# EAGLE design usbhub (EAGLE 7.6.0)
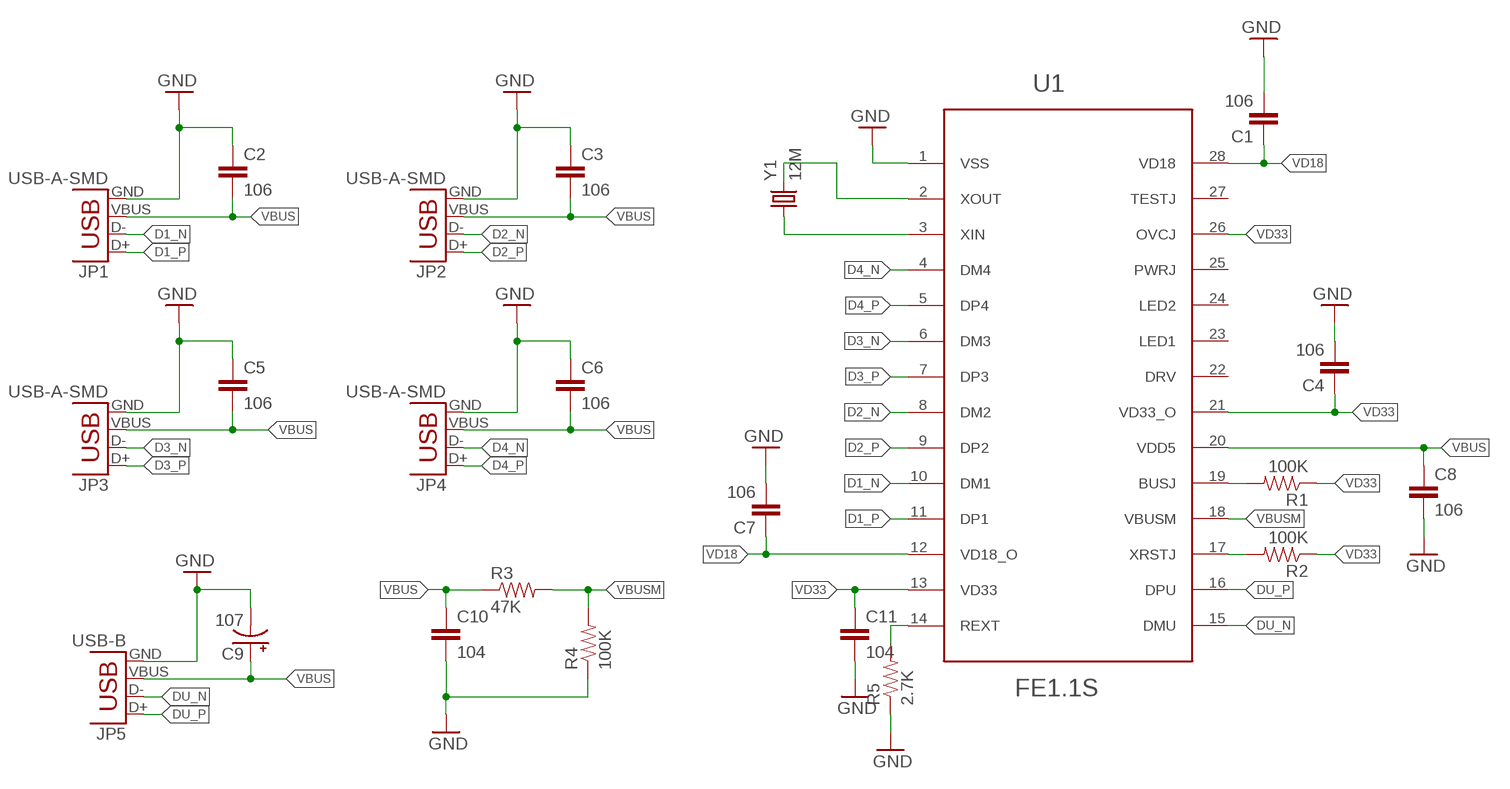
[diagram p0: schematic, sheet 1]

## Parts
C1  106  CAP0603-CAP  [0603-CAP]
C2  106  CAP0603-CAP  [0603-CAP]
C3  106  CAP0603-CAP  [0603-CAP]
C4  106  CAP0603-CAP  [0603-CAP]
C5  106  CAP0603-CAP  [0603-CAP]
C6  106  CAP0603-CAP  [0603-CAP]
C7  106  CAP0603-CAP  [0603-CAP]
C8  106  CAP0603-CAP  [0603-CAP]
C9  107  CAP_POL3528-KIT  [EIA3528-KIT]
C10  104  CAP0603-CAP  [0603-CAP]
C11  104  CAP0603-CAP  [0603-CAP]
JP1  USB-A-SMD  [USB-A-S-NOSILK-FEMALE]
JP2  USB-A-SMD  [USB-A-S-NOSILK-FEMALE]
JP3  USB-A-SMD  [USB-A-S-NOSILK-FEMALE]
JP4  USB-A-SMD  [USB-A-S-NOSILK-FEMALE]
JP5  USB-B  USBPTH  [USB-B-PTH]
R1  100K  RESISTOR0603-RES  [0603-RES]
R2  100K  RESISTOR0603-RES  [0603-RES]
R3  47K  RESISTOR0603-RES  [0603-RES]
R4  100K  RESISTOR0603-RES  [0603-RES]
R5  2.7K  RESISTOR0603-RES  [0603-RES]
U1  FE1.1S  [SSOP28-39]
Y1  12M  CRYSTAL2HC49US  [HC49US]

## Nets
D1_N: JP1.D- U1.10(DM1)
D1_P: JP1.D+ U1.11(DP1)
D2_N: JP2.D- U1.8(DM2)
D2_P: JP2.D+ U1.9(DP2)
D3_N: JP3.D- U1.6(DM3)
D3_P: JP3.D+ U1.7(DP3)
D4_N: JP4.D- U1.4(DM4)
D4_P: JP4.D+ U1.5(DP4)
DU_N: JP5.D- U1.15(DMU)
DU_P: JP5.D+ U1.16(DPU)
GND: C1.2 C2.1 C3.1 C4.2 C5.1 C6.1 C7.2 C8.2 C9.C(-) C10.2 C11.2 JP1.GND JP2.GND JP3.GND JP4.GND JP5.GND R4.1 R5.1 U1.1(VSS)
N$1: U1.2(XOUT) Y1.2
N$4: U1.3(XIN) Y1.1
N$6: R5.2 U1.14(REXT)
N$7: R1.2 U1.19(BUSJ)
N$8: R2.2 U1.17(XRSTJ)
VBUS: C2.2 C3.2 C5.2 C6.2 C8.1 C9.A(+) C10.1 JP1.VBUS JP2.VBUS JP3.VBUS JP4.VBUS JP5.VBUS R3.1 U1.20(VDD5)
VBUSM: R3.2 R4.2 U1.18(VBUSM)
VD18: C1.1 C7.1 U1.12(VD18_O) U1.28(VD18)
VD33: C4.1 C11.1 R1.1 R2.1 U1.13(VD33) U1.21(VD33_O) U1.26(OVCJ)
Unconnected: U1.22(DRV) U1.23(LED1) U1.24(LED2) U1.25(PWRJ) U1.27(TESTJ)

## Library data of the parts
C1 C4 C7 C8 C11 = xmgu2008:CAP: Capacitor Standard 0603 ceramic capacitor, and 0.1" leaded capacitor.
C2 C3 C5 C6 C10 = z_jlc_smt:CAP: Capacitor Standard 0603 ceramic capacitor, and 0.1" leaded capacitor.
C9 = z_jlc_smt:CAP_POL: Capacitor Polarized These are standard SMD and PTH capacitors. Normally 10uF, 47uF, and 100uF in electrolytic and tantalum varieties. Always verify the external diameter of the through hole cap, it varies with capacity, voltage, and manufacturer. The EIA devices should be standard.
JP1-JP4 = xmgu2008:USB: USB Connectors USB-B-PTH is fully proven SKU : PRT-00139/CONN-08278 USB-miniB is fully proven SKU : PRT-00587 USB-A-PCB is untested. USB-A-H is throughly reviewed, but untested. Spark Fun Electronics SKU : PRT-00437 USB-B-SMT is throughly reviewed, but untested. Needs silkscreen touching up. USB-A-S has not been used/tested USB-MB-H has not been used/tested USB-MICROB has been used. CONN-09505; PROD_ID: CONN-09520
JP5 = xmgu2008:USB: USB Connectors USB-B-PTH is fully proven SKU : PRT-00139/CONN-08278 USB-miniB is fully proven SKU : PRT-00587 USB-A-PCB is untested. USB-A-H is throughly reviewed, but untested. Spark Fun Electronics SKU : PRT-00437 USB-B-SMT is throughly reviewed, but untested. Needs silkscreen touching up. USB-A-S has not been used/tested USB-MB-H has not been used/tested USB-MICROB has been used. CONN-09505; PROD_ID: CONN-08278
R1-R5 = xmgu2008:RESISTOR: Resistor Basic schematic elements and footprints for 0603, 1206, and PTH resistors.
U1 = xmgu2008:FE1.1S
Y1 = xmgu2008:CRYSTAL2: Various standard crystals. Proven footprints.

## Board
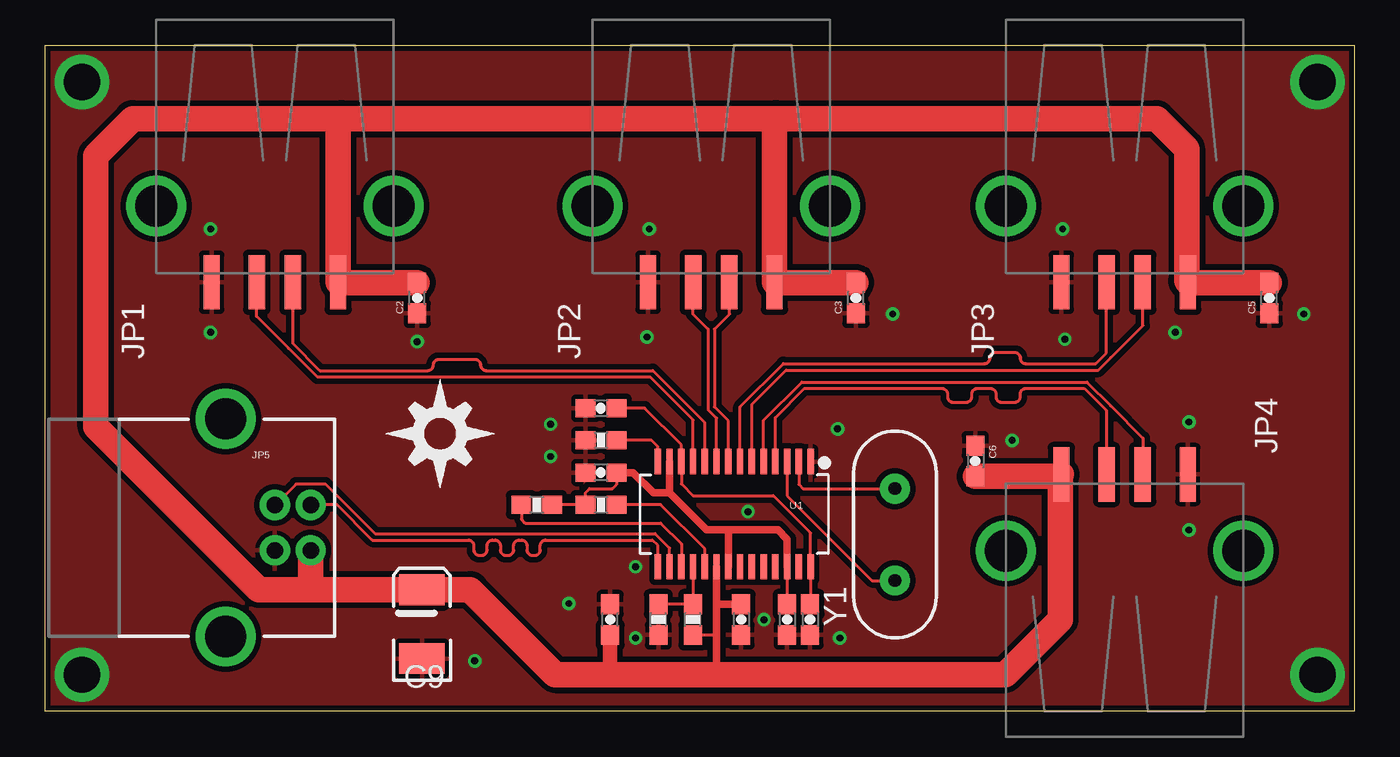
[diagram p1: board, top side]
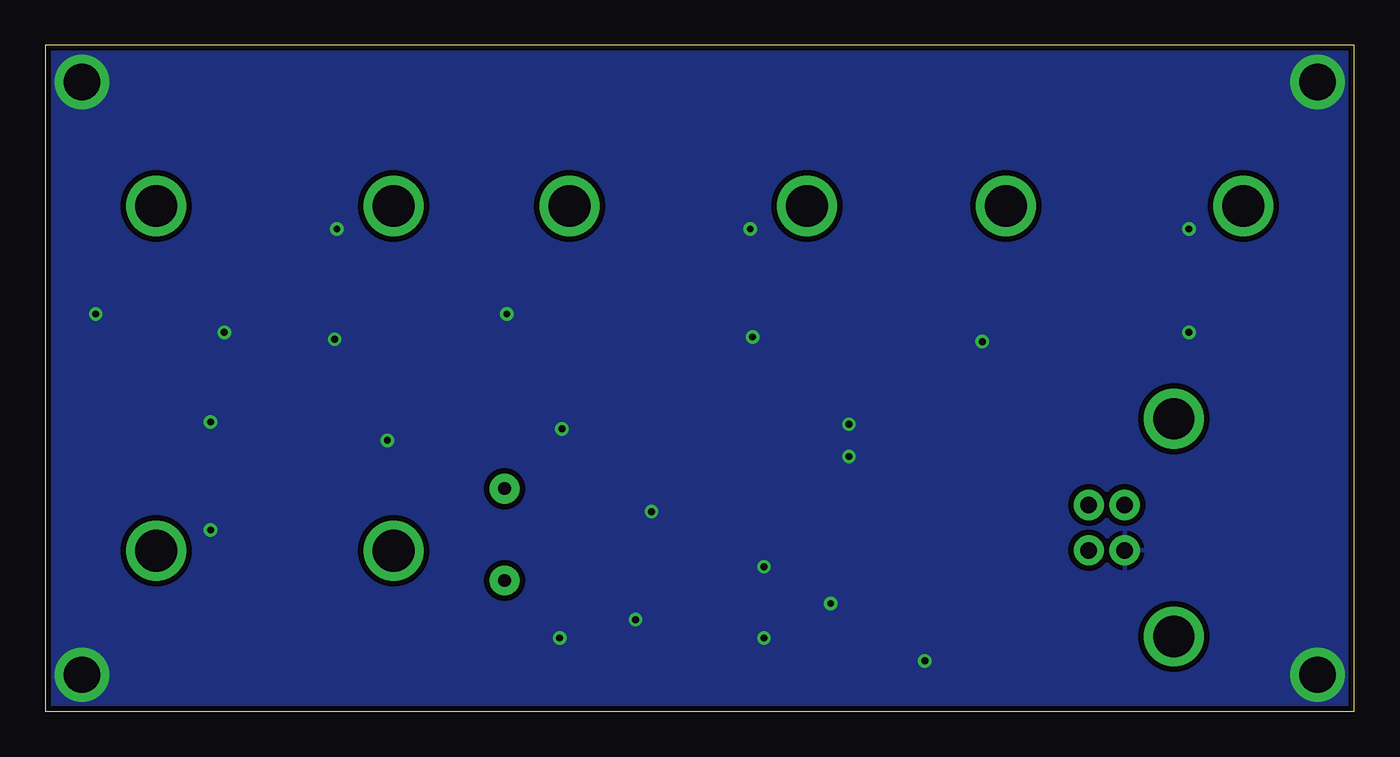
[diagram p2: board, bottom side, seen from below]

Size 72.39 x 36.83 mm. Coordinates in mm from the lower left corner, seen from the top.
Outline: 0,0 0,36.83 72.39,36.83 72.39,0 0,0
Copper layers (1*16): Top 0.035mm / dielectric 1.5mm / Bottom 0.035mm
Design rules "SparkFun-2-layer-TIGHT": minimum track width 7mil, minimum drill 15mil, track to track 7mil, track to pad 7mil, pad to pad 7mil, via to via 7mil, smd to smd 7mil, copper to edge 7mil, drill to drill 7mil, minimum pad ring 7mil, minimum via ring 7mil, stop-mask expansion 4mil, vias tented up to drill 20mil, thermal gap 10mil

### Footprints (pad centres in the part's own frame; a part is rotated, then mirrored left to right if it is on the bottom)
0603-CAP = smd 1.1 x 1: 1 -0.85,0; 2 0.85,0
EIA3528-KIT = smd 1.7 x 2.5: A 1.9,0; C -1.9,0
USB-A-S-NOSILK-FEMALE = smd 3 x 0.9: D+ 4.212,-1; D- 4.212,1; GND 4.212,-3.5; VBUS 4.212,3.5 | drill 2.311: S1 0,-6.566; S2 0,6.566
USB-B-PTH = drill 0.914 pad 1.676: D+ 0,1.25; D- 1.981,1.25; GND 0,-1.25; VBUS 1.981,-1.25 | drill 2.286: S1 -2.718,-6.02; S2 -2.718,6.02
0603-RES = smd 1.1 x 1: 1 -0.85,0; 2 0.85,0
SSOP28-39 = smd 0.348 x 1.397: 1 -4.225,-3.656; 2 -3.575,-3.656; 3 -2.925,-3.656; 4 -2.275,-3.656; 5 -1.625,-3.656; 6 -0.975,-3.656; 7 -0.325,-3.656; 8 0.325,-3.656; 9 0.975,-3.656; 10 1.625,-3.656; 11 2.275,-3.656; 12 2.925,-3.656; 13 3.575,-3.656; 14 4.225,-3.656; 15 4.225,2.156; 16 3.575,2.156; 17 2.925,2.156; 18 2.275,2.156; 19 1.625,2.156; 20 0.975,2.156; 21 0.325,2.156; 22 -0.325,2.156; 23 -0.975,2.156; 24 -1.625,2.156; 25 -2.275,2.156; 26 -2.925,2.156; 27 -3.575,2.156; 28 -4.225,2.156
HC49US = drill 0.7 pad 1.651: 1 -2.54,0; 2 2.54,0

### Placement (x,y rotation side)
C1  42.29,5.08 270 top
C2  20.57,22.86 90 top
C3  44.83,22.86 90 top
C4  41.02,5.08 270 top
C5  67.69,22.86 90 top
C6  51.44,13.84 270 top
C7  30.73,16.76 180 top
C8  31.24,5.08 90 top
C9  20.83,4.83 90 top
C10  38.48,5.08 270 top
C11  30.73,13.21 180 top
JP1  12.7,27.94 270 top
JP2  36.83,27.94 270 top
JP3  59.69,27.94 270 top
JP4  59.69,8.89 90 top
JP5  12.7,10.16 0 top
R1  30.73,11.43 0 top
R2  27.18,11.43 180 top
R3  35.81,5.08 90 top
R4  33.91,5.08 90 top
R5  30.73,14.99 0 top
U1  38.1,10.16 180 top
U$1  [DIYNOVA_LOGO]  18.8,12.32 0 top
Y1  46.99,9.78 90 top

### Tracks (layer width: path | path; a pad name or v marks a point on that pad's centre or on a via)
D1_N
  Top 0.178: U1.10 36.48,15.97 33.6,18.85 24.38,18.85 arc-90 24.07,19.16 arc90 23.76,19.47 21.78,19.47 arc90 21.47,19.16 arc-90 21.16,18.85 15.19,18.85 13.71,20.32 13.71,23.71 JP1.D-
D1_P
  Top 0.178: U1.11 35.83,16.12 33.45,18.49 15.04,18.49 13.46,20.07 11.68,21.84 11.68,23.71 JP1.D+
D2_N
  Top 0.178: U1.8 37.77,16.07 37.01,16.84 37.01,21.13 37.85,21.97 37.85,23.71 JP2.D-
D2_P
  Top 0.178: U1.9 37.12,16.22 36.65,16.69 36.65,21.13 35.81,21.97 35.81,23.71 JP2.D+
D3_N
  Top 0.178: U1.6 39.08,16.98 40.97,18.87 58.24,18.87 58.93,19.56 60.71,21.34 60.71,23.71 JP3.D-
D3_P
  Top 0.178: U1.7 38.42,16.83 40.82,19.23 51.93,19.23 arc90 52.24,19.54 arc-90 52.55,19.85 53.61,19.85 arc-90 53.92,19.54 arc90 54.23,19.23 58.09,19.23 58.67,19.81 58.67,23.71 JP3.D+
D4_N
  Top 0.178: U1.4 40.38,16.25 41.98,17.86 49.59,17.86 arc-90 49.9,17.55 49.9,17.4 arc90 50.21,17.09 50.92,17.09 arc90 51.24,17.4 51.24,17.55 arc-90 51.55,17.86 52.27,17.86 arc-90 52.58,17.55 52.58,17.4 arc90 52.89,17.09 53.61,17.09 arc90 53.92,17.4 53.92,17.55 arc-90 54.23,17.86 57.46,17.86 58.67,16.64 58.67,13.12 JP4.D-
D4_P
  Top 0.178: U1.5 39.73,16.1 41.84,18.21 57.6,18.21 58.93,16.89 60.71,15.11 60.71,13.12 JP4.D+
DU_N
  Top 0.178: U1.15 33.88,9.18 33.58,9.47 27.69,9.47 arc90 27.38,9.16 27.38,8.94 arc-90 27.06,8.62 26.95,8.62 arc-90 26.64,8.94 26.64,9.16 arc90 26.33,9.47 26.22,9.47 arc90 25.91,9.16 25.91,8.94 arc-90 25.59,8.62 25.48,8.62 arc-90 25.17,8.94 25.17,9.16 arc90 24.86,9.47 24.75,9.47 arc90 24.43,9.16 24.43,8.94 arc-90 24.12,8.62 24.01,8.62 arc-90 23.7,8.94 23.7,9.16 arc90 23.39,9.47 18.09,9.47 16.13,11.43 14.7,11.43 JP5.D-
DU_P
  Top 0.178: U1.16 34.52,9.03 33.73,9.83 18.23,9.83 16.38,11.68 16.38,11.69 15.49,12.57 13.86,12.57 JP5.D+
GND  (via drill 0.38, 2.01)
  other vias: 32.64,8 38.86,11.05 43.81,15.62 46.86,21.97 20.57,20.45 56.39,20.57 53.47,14.99 32.64,4.06 2.03,34.8 2.03,2.03 70.36,34.8 70.36,2.03 43.94,4.06 27.94,15.88 27.94,14.1 9.14,20.95 63.25,16 33.27,20.7 62.48,20.95 28.96,5.97 23.75,2.79 63.25,10.03 69.6,21.97 9.14,26.67 33.4,26.67 56.26,26.67 39.75,5.08
  pour Bottom (isolate 0.305): 0,0 0,36.83 72.39,36.83 72.39,0
  pour Top (isolate 0.305): 0,0 0,36.83 72.39,36.83 72.39,0
N$1
  Top 0.178: U1.2 41.67,12.55 41.91,12.32 Y1.2
N$4
  Top 0.178: U1.3 41.02,11.93 45.72,7.24 Y1.1
N$6
  Top 0.178: U1.14 33.88,14.64 33.53,14.99 R5.2
N$7
  Top 0.178: U1.19 36.48,8.99 34.04,11.43 R1.2
N$8
  Top 0.178: R2.2 26.33,10.63 26.54,10.41 34.04,10.41 35.18,9.27 U1.17
VBUS
  Top 0.178: R3.1 37.09,4.23 37.12,4.19
  Top 0.406: U1.20 37.12,5.97 | C10.1 37.16,5.93 37.12,5.97 | 37.12,5.97 37.12,4.19 37.12,2.12 37.21,2.03
  Top 0.813: C9.A | C8.1 31.24,2.03
  Top 1.422: 14.86,6.73 C9.A 23.5,6.73 28.19,2.03 31.24,2.03 37.21,2.03 53.09,2.03 56.13,5.08 56.13,13.05 JP4.VBUS 56.08,12.99 C6.2 | 14.86,6.73 11.81,6.73 2.79,15.75 2.79,30.73 4.83,32.77 16.38,32.77 | 16.38,32.77 40.39,32.77 | 40.39,32.77 61.47,32.77 63.12,31.11 63.12,23.8 JP3.VBUS 63.21,23.71 C5.2 | 40.39,32.77 40.33,32.71 JP2.VBUS 40.35,23.71 C3.2 | 16.38,32.77 16.2,32.58 JP1.VBUS 16.22,23.71 C2.2 | JP5.VBUS 14.68,6.91 14.86,6.73
VBUSM
  Top 0.178: U1.18 35.83,5.94 | 35.83,5.94 R3.2 | 35.83,5.94 R4.2
VD18
  Top 0.178: C1.1 42.33,5.96 U1.28 42.33,9.87 40.26,11.94 35.81,11.94 35.17,12.58 U1.12 35.17,14.74 33.15,16.76 C7.1
VD33
  Top 0.178: U1.26 C4.1 | C11.1 31.58,12.53 31.37,12.32 30.1,12.32 29.88,12.1 R1.1 R2.1
  Top 0.406: U1.13 34.52,12.08 | 34.52,12.08 36.58,10.03 37.72,10.03 | 37.72,10.03 40.51,10.03 41.02,9.53 U1.26 | U1.21 37.77,9.98 37.72,10.03 | 34.52,12.08 33.64,12.08 32.51,13.21 C11.1